# Altium schematic sheet DC-DC switching regulator.SchDoc: DC-DC switching regulator
size A4; DocumentNumber: 1; Revision: 1; SheetNumber: 1; SheetTotal: 1
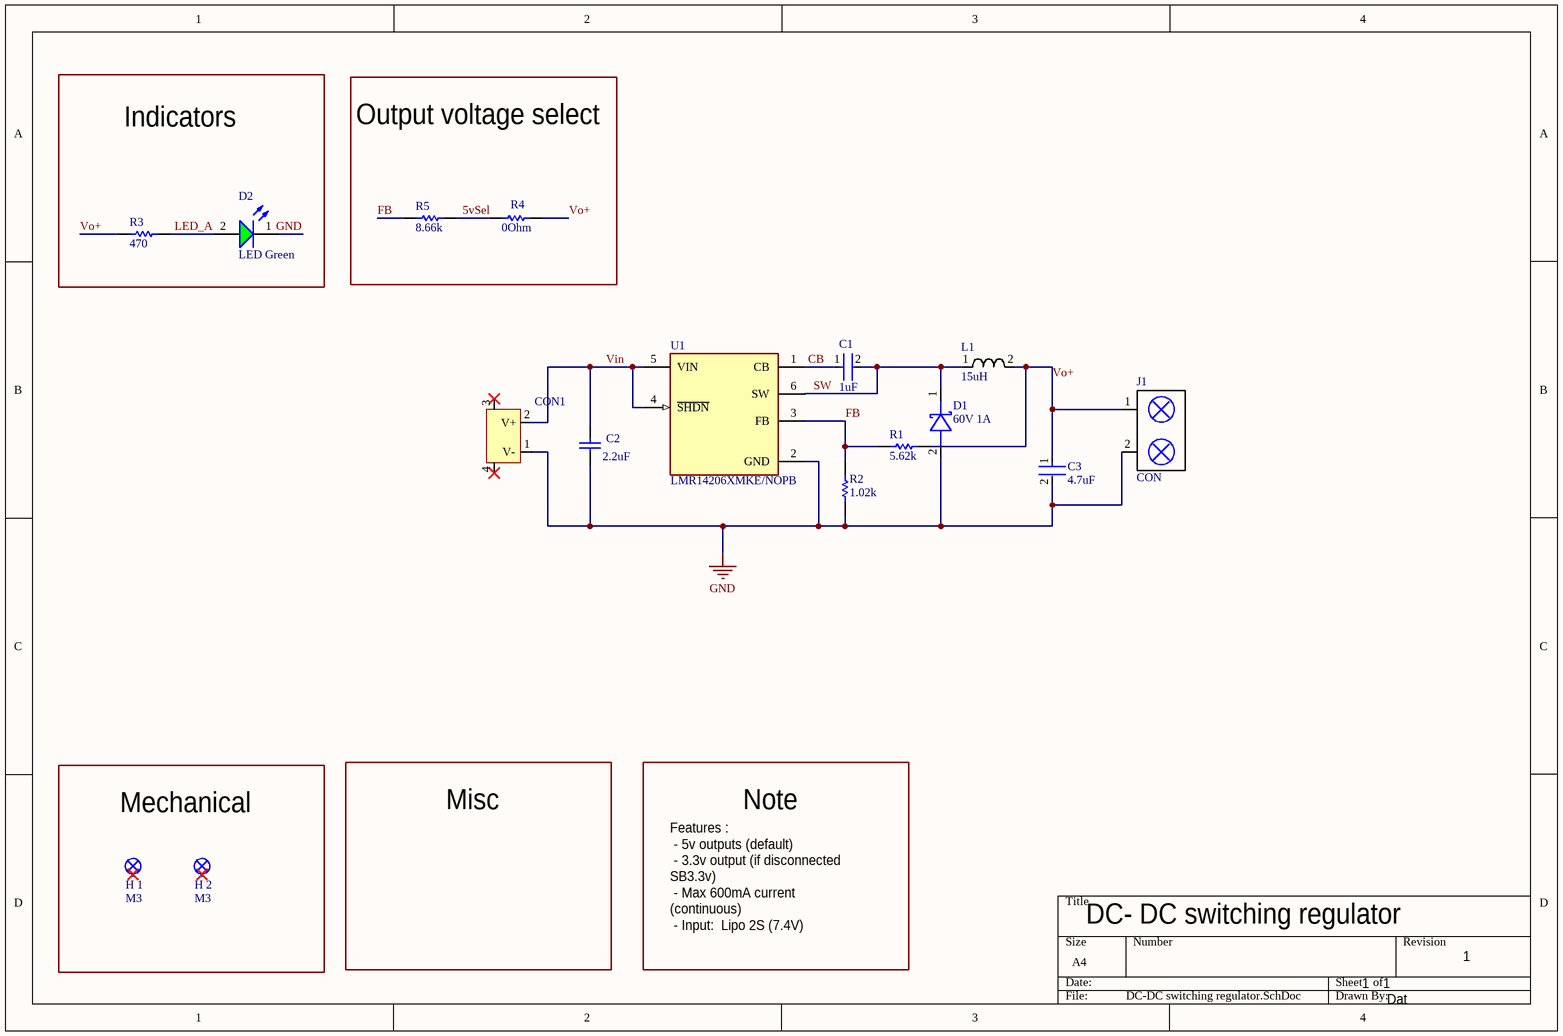
[diagram p0: DC-DC switching regulator.SchDoc]

## Parts
C1  1uF  [FP-CL21-IPC_A]
C2  2.2uF  [CAPC2013X145X50LL20T25]
C3  4.7uF  [FP-GRM31C-0_2-e0_3_0_8-IPC_C]
CON1  XT60PW-M  [XT60PW-M]  (value not drawn)
D1  60V 1A  [SODFL2512X80N]
D2  LED Green  [WL-SMCW_0805_150080xx75000]
H_1  M3  [M3]
H_2  M3  [M3]
J1  CON  [XY308-2.54-2P]
L1  15uH  [CMLW6020S150MST]
R1  5.62k  [RESC2013X70X40ML20T20]
R2  1.02k  [RESC2013X50X30NL20T20]
R3  470  [RESC2013X50X30LL20T20]
R4  0Ohm  [RESC2013X50X30NL20T20]
R5  8.66k  [RESC2013X50X30NL20T20]
U1  LMR14206XMKE/NOPB  [FP-DDC0006A-MFG]

## Blocks framed on the sheet
Indicators: D2 R3
Output voltage select: R4 R5
Mechanical: H_1 H_2

## Nets
GND: C2.1 C3.2 CON1.1(V-) D1.2(A) D2.1(K) J1.2 R2.1 U1.2(GND)
5vSel: R4.2 R5.1
CB: C1.1 U1.1(CB)
FB: R1.1 R2.2 R5.2 U1.3(FB)
LED_A: D2.2(A) R3.1
SW: C1.2 D1.1(K) L1.1 U1.6(SW)
Vin: C2.2 CON1.2(V+) U1.4(~{SHDN}) U1.5(VIN)
Vo+: C3.1 J1.1 L1.2 R1.2 R3.2 R4.1

Not connected (* = marked no-connect by the designer): CON1 3* 4*; H_1 1*; H_2 1*

## Notes on the sheet
- Misc
- Note
- DC- DC switching regulator
- Features :
  - 5v outputs (default)
  - 3.3v output (if disconnected SB3.3v)
  - Max 600mA current (continuous)
  - Input:  Lipo 2S (7.4V)
- 1
- Dat

## Library data of the parts
C1 = CMP-13271-003098-1: 50V 1uF X7R ±10% 0805 Multilayer Ceramic Capacitors MLCC - SMD/SMT ROHS; Voltage Rating: 16V; Case Code (Metric): 2012; Width: 0.049inch; Thickness: 0.053inch; Max Operating Temperature: 125°C; Case Code (Imperial): 0805; Height: 1.25mm; Length: 2mm; Case/Package: 0805; Lead Free: Lead Free; Mount: Surface Mount; Capacitance: 1uF; Tolerance: 10%; Voltage Rating (DC): 16V; Min Operating Temperature: -55°C; Contact Plating: Tin; Depth: 1.25mm; Packaging: Tape and Reel; Package Quantity: 1; Voltage: 16V; Dielectric: X7R; Radiation Hardening: No; ComponentLink1Description: Datasheet; ComponentLink1URL: https://wmsc.lcsc.com/wmsc/upload/file/pdf/v2/lcsc/2304140030_Samsung-Electro-Mechanics-CL21B105KBFNNNE_C28323.pdf; JLCPCB Part #: C28323; ComponentLink2Description: JCLPCB; ComponentLink2URL: https://jlcpcb.com/partdetail/29074-CL21B105KBFNNNE/C28323; Package: 0805
C2 = CMP-2007-01169-1: 25V 2.2uF X7R ±10% 0805 Multilayer Ceramic Capacitors MLCC - SMD/SMT ROHS; Manufacturer: Samsung Electro-Mechanics; Part Number: C0805C225K4RAC7800; JLCPCB Part #: C19110; ComponentLink1Description: Datasheet; ComponentLink1URL: https://wmsc.lcsc.com/wmsc/upload/file/pdf/v2/lcsc/2304140030_Samsung-Electro-Mechanics-CL21B225KAFNNNE_C19110.pdf; ComponentLink2Description: JLCPCB; ComponentLink2URL: https://jlcpcb.com/partdetail/19814-CL21B225KAFNNNE/C19110; Package: 0805
C3 = CMP-1037-04923-3: 50V 4.7uF X7R ±10% 1206 Multilayer Ceramic Capacitors MLCC - SMD/SMT ROHS; MFR.Part #: CL31B475KBHNNNE; Height: 1.6mm; Voltage: 50V; Capacitance: 4.7uF; Lead Free: Lead Free; Max Operating Temperature: 125°C; Packaging: Tape and Reel; REACH SVHC: No SVHC; Voltage Rating: 50V; Mount: Surface Mount; Termination: SMD/SMT; Tolerance: 10%; Case/Package: 1206; Material: Ceramic; Depth: 1.6mm; Length: 3.2mm; Case Code (Metric): 3216; Voltage Rating (DC): 50V; Case Code (Imperial): 1206; Radiation Hardening: No; Width: 0.063inch; Thickness: 0.071inch; Package Quantity: 2000; Min Operating Temperature: -55°C; Dielectric: X7R; JLCPCB Part #: C51205; ComponentLink1Description: Datasheet; ComponentLink1URL: https://wmsc.lcsc.com/wmsc/upload/file/pdf/v2/lcsc/2304140030_Samsung-Electro-Mechanics-CL31B475KBHNNNE_C51205.pdf; ComponentLink2Description: JLCPCB; ComponentLink2URL: https://jlcpcb.com/partdetail/52218-CL31B475KBHNNNE/C51205; Package: 1206
CON1 = XT60PW-M: Power Connectors ROHS; JLCPCB Part #: C98732; MFR.Part #: XT60PW-M; ComponentLink1Description: JLCPCB; ComponentLink1URL: https://jlcpcb.com/partdetail/Changzhou_AmassElec-XT60PWM/C98732; ComponentLink2Description: Datasheet; ComponentLink2URL: https://wmsc.lcsc.com/wmsc/upload/file/pdf/v2/lcsc/1810251313_Changzhou-Amass-Elec-XT60PW-M_C98732.pdf
D1 = BAS16J: 60V Single 700mV@1A 1A SOD-323 Schottky Barrier Diodes (SBD) ROHS; JLCPCB Part #: C7420327; ComponentLink1Description: JCLPCB; ComponentLink1URL: https://jlcpcb.com/partdetail/Hongjiacheng-B16WS/C7420327; ComponentLink2Description: Datasheet; ComponentLink2URL: https://wmsc.lcsc.com/wmsc/upload/file/pdf/v2/lcsc/2308281514_hongjiacheng-B16WS_C7420327.pdf; Package: SOD-323
D2 = CMP-1426-00009-5: Emerald 0805 Light Emitting Diodes (LED) ROHS; NexarPartId: 29717783; MFR.Part #: KT-0805G; Dominant Wavelength: 570nm; Lens Style: Clear, Rectangular; Test Current: 20mA; Max Junction Temperature (Tj): 95°C; Max Reverse Voltage (DC): 5V; Forward Voltage: 2V; Forward Current: 100mA; Viewing Angle: 140°; Power Dissipation: 72mW; Peak Wavelength: 572nm; Luminous Intensity: 40mcd; Color: Green; Max Operating Temperature: 85°C; Case/Package: 0805; Case Code (Metric): 2012; RoHS: Compliant; Packaging: Tape and Reel; Min Operating Temperature: -40°C; Width: 1.25mm; Wavelength: 570nm; Mount: Surface Mount; Length: 2mm; REACH SVHC: Unknown; Height: 700µm; Case Code (Imperial): 0805; Reverse Voltage: 5V; JLCPCB Part #: C2297; ComponentLink1Description: JLCPCB; ComponentLink1URL: https://jlcpcb.com/partdetail/Hubei_KentoElec-KT0805G/C2297; ComponentLink2Description: datasheet; ComponentLink2URL: https://wmsc.lcsc.com/wmsc/upload/file/pdf/v2/lcsc/1806151820_Hubei-KENTO-Elec-KT-0805G_C2297.pdf; Package: 0805
H_1 H_2 = M3: M3 drill hole
J1 = XY308-2.54-2P: 1x2P 6A 150V Green 18~26 Straight 2.54mm 1 1 2 Plugin,P=2.54mm Screw terminal ROHS; MFR.Part #: XY308-2.54-2P; JLCPCB Part #: C557685; ComponentLink1Description: Datasheet; ComponentLink1URL: https://wmsc.lcsc.com/wmsc/upload/file/pdf/v2/lcsc/2304140030_Ningbo-Xinlaiya-Elec--XY308-2-54-2P_C557685.pdf; ComponentLink2Description: JLCPCB; ComponentLink2URL: https://jlcpcb.com/partdetail/Ningbo_Xinlaiya_elec-XY308_2_542P/C557685
L1 = CMLW6020S150MST: 1.2A 15uH Shielded Power Inductors ±20% SMD,6x6mm Power Inductors ROHS; JLCPCB Part #: C431352; ComponentLink1Description: JLCPCB Link; ComponentLink1URL: https://jlcpcb.com/partdetail/Cybermax-CMLW6020S150MST/C431352; ComponentLink2Description: Datasheet; ComponentLink2URL: https://wmsc.lcsc.com/wmsc/upload/file/pdf/v2/lcsc/2304140030_Cybermax-CMLW6020S150MST_C431352.pdf; MFR.Part #: CMLW6020S150MST; Package: SMD,6x6mm
R1 = CMP-2001-00238-1: 125mW Thick Film Resistors ±100ppm/℃ ±1% 5.62kΩ 0805 Chip Resistor - Surface Mount ROHS; MFR.Part #: CR0805-FX-5621ELF; JLCPCB Part #: C204581; ComponentLink1Description: Datasheet; ComponentLink1URL: https://wmsc.lcsc.com/wmsc/upload/file/pdf/v2/lcsc/2304140030_BOURNS-CR0805-FX-5621ELF_C204581.pdf; ComponentLink2Description: JCLPCB; ComponentLink2URL: https://jlcpcb.com/parts/componentSearch?searchTxt=5.62k%20resistor; Package: 0805
R2 = CMP-1013-00511-2: 125mW Thick Film Resistors 150V ±100ppm/℃ ±1% 1.02kΩ 0805 Chip Resistor - Surface Mount ROHS; MFR.Part #: 0805W8F1021T5E; JLCPCB Part #: C17369; ComponentLink1Description: Datasheet; ComponentLink1URL: https://wmsc.lcsc.com/wmsc/upload/file/pdf/v2/lcsc/2206010216_UNI-ROYAL-Uniroyal-Elec-0805W8F1021T5E_C17369.pdf; ComponentLink2Description: JLCPCB; ComponentLink2URL: https://jlcpcb.com/partdetail/18057-0805W8F1021T5E/C17369; Package: 0805
R3 = CMP-1013-00511-2: 125mW Thick Film Resistors 150V ±100ppm/℃ ±1% 470Ω 0805 Chip Resistor - Surface Mount ROHS; MFR.Part #: 0805W8F4700T5E; JLCPCB Part #: C17710; ComponentLink1Description: Datasheet; ComponentLink1URL: https://wmsc.lcsc.com/wmsc/upload/file/pdf/v2/lcsc/2206010200_UNI-ROYAL-Uniroyal-Elec-0805W8F4700T5E_C17710.pdf; ComponentLink2Description: JLCPCB; ComponentLink2URL: https://jlcpcb.com/parts/componentSearch?searchTxt=470ohm%200805; Package: 0805
R4 = CMP-1013-00511-2: 125mW Thick Film Resistors 150V ±800ppm/℃ ±1% 0Ω 0805  Chip Resistor - Surface Mount ROHS; MFR.Part #: 0805W8F0000T5E; JLCPCB Part #: C17477; ComponentLink1Description: Datasheet; ComponentLink1URL: https://wmsc.lcsc.com/wmsc/upload/file/pdf/v2/lcsc/2206010216_UNI-ROYAL-Uniroyal-Elec-0805W8F0000T5E_C17477.pdf; ComponentLink2Description: JLCPCB; ComponentLink2URL: https://jlcpcb.com/partdetail/18165-0805W8F0000T5E/C17477; Package: 0805
R5 = CMP-1013-00511-2: 125mW Thick Film Resistors 150V ±100ppm/℃ ±1% 8.66kΩ 0805  Chip Resistor - Surface Mount ROHS; MFR.Part #: 0805W8F8661T5E; JLCPCB Part #: C17832; ComponentLink1Description: Datasheet; ComponentLink1URL: https://wmsc.lcsc.com/wmsc/upload/file/pdf/v2/lcsc/2205311830_UNI-ROYAL-Uniroyal-Elec-0805W8F8661T5E_C17832.pdf; ComponentLink2Description: JLCPCB; ComponentLink2URL: https://jlcpcb.com/parts/componentSearch?searchTxt=0805%20%C2%B11%25%208.66k%CE%A9; Package: 0805
U1 = CMP-04918-000054-1: IC REG BUCK ADJ 600MA TSOT23-6; Manufacturer: Texas Instruments; Nominal Supply Current: 1.3-1.35mA; Output Type: AdjustableProgrammable; Max Supply Voltage: 42V; Number Of Outputs: 1; Switching Frequency: 1.25MHz; Standoff Height: 0mm; Min Supply Voltage: 4.5V; Max Junction Temp: +125°C; Max Duty Cycle: 87%; Output Current: 0.6A; Output Voltage: 0.765-34V; Device Class L1: Integrated Circuits (ICs); Automotive: No; Manufacturer Part Number: LMR14206XMKE/NOPB; Switching Topology: Buck; Digikey Description: IC REG BUCK ADJ 600MA TSOT23-6; Temperature Range Low: -40°C; Device Class L2: Power Management ICs; Package: TSOT-23-6; Temperature: -40°C to +125°C; Lead Free: Yes; Temperature Range High: +125°C; Height: 1.1mm; ComponentLink2URL: http://www.ti.com/lit/ds/symlink/lmr14206.pdf; RoHS: TRUE; Mouser Description: Voltage Regulators - Switching Regulators SIMPLE SWITCHER 42 Vin,0.6A SD Vltg Reg; Category: IC; Ipc Land Pattern Name: SOT95P280X110-6; Device Class L3: Voltage Regulators - Switching; ComponentLink2Description: Datasheet; Octopart: https://octopart.com/lmr14206xmke%2Fnopb-texas+instruments-24815773; JLCPCB Part #: C2071127; ComponentLink3Description: JLCPCB; ComponentLink3URL: https://jlcpcb.com/parts/componentSearch?searchTxt=LMR14206XMKE%2FNOPB